# Altium schematic sheet SCH.SchDoc
size A4
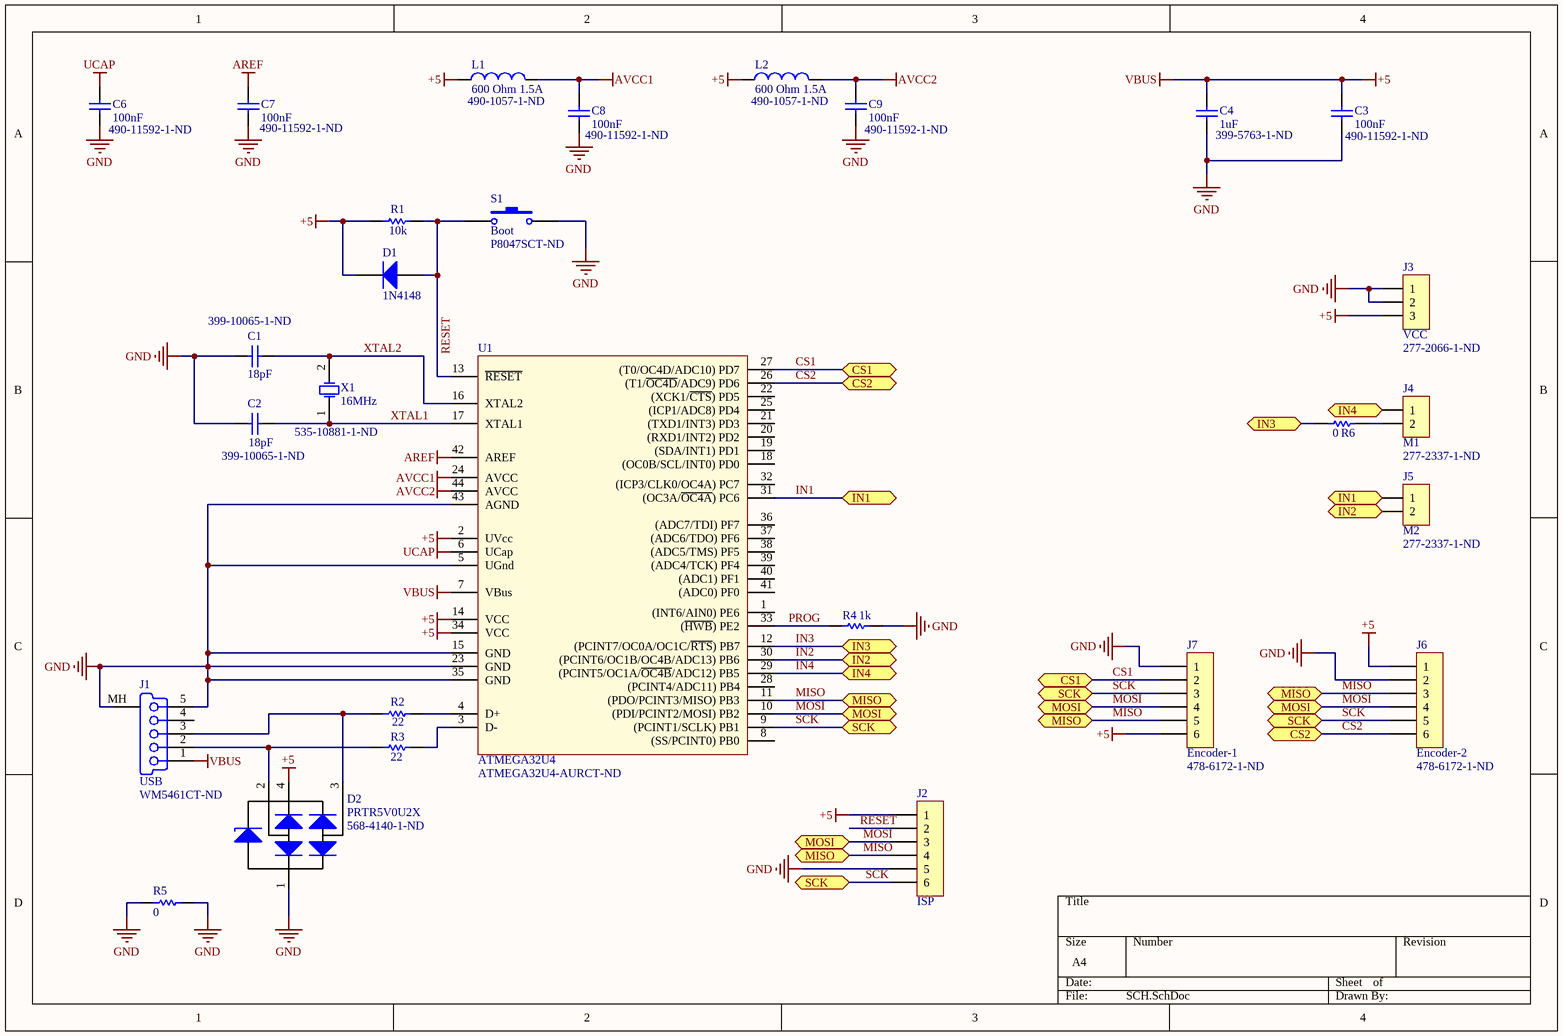
[diagram p0: SCH.SchDoc]

## Parts
C1  18pF  Supplier Part Number 1: 399-10065-1-ND  [C0805]
C2  18pF  Supplier Part Number 1: 399-10065-1-ND  [C0805]
C3  100nF  Supplier Part Number 1: 490-11592-1-ND  [C0805]
C4  1uF  Supplier Part Number 1: 399-5763-1-ND  [C0805]
C6  100nF  Supplier Part Number 1: 490-11592-1-ND  [C0805]
C7  100nF  Supplier Part Number 1: 490-11592-1-ND  [C0805]
C8  100nF  Supplier Part Number 1: 490-11592-1-ND  [C0805]
C9  100nF  Supplier Part Number 1: 490-11592-1-ND  [C0805]
D1  1N4148  [SOD-123]
D2  PRTR5V0U2X  Supplier Part Number 1: 568-4140-1-ND  [SOT143B]
J1  USB  Supplier Part Number 1: WM5461CT-ND  [USB Mini-B SMD]
J2  ISP  [Header-3x2]
J3  VCC  Supplier Part Number 1: 277-2066-1-ND  [TB_SMD_3v]
J4  M1  Supplier Part Number 3: 277-2337-1-ND  [TB_SMD_2V]
J5  M2  Supplier Part Number 3: 277-2337-1-ND  [TB_SMD_2V]
J6  Encoder-2  Supplier Part Number 4: 478-6172-1-ND  [Poke Home H6]
J7  Encoder-1  Supplier Part Number 1: 478-6172-1-ND  [Poke Home H6]
L1  600 Ohm 1.5A  Supplier Part Number 1: 490-1057-1-ND  [CC_1206]
L2  600 Ohm 1.5A  Supplier Part Number 1: 490-1057-1-ND  [CC_1206]
R1  10k  [RES_1206]
R2  22  [RES_1206]
R3  22  [RES_1206]
R4  1k  [RES_1206]
R5  0  [1206-0Ohm]
R6  0  [1206-0Ohm]
S1  Boot  Supplier Part Number 1: P8047SCT-ND  [EVQPL]
U1  ATMEGA32U4  Supplier Part Number 1: ATMEGA32U4-AURCT-ND  [TQFP44]
X1  16MHz  Supplier Part Number 1: 535-10881-1-ND  [ABM2 - XTAL]

## Ports
CS1, CS2, IN1, IN2, IN3, IN4, MISO, MOSI, SCK

## Nets
+5: C3.2 C4.2 D1.1(K) D2.4(VBUS) J1.1(V_BUS_(5V)) J2.1 J3.3 J6.1 J7.6 L1.1 L2.1 R1.1 U1.2(UVcc) U1.7(VBus) U1.14(VCC) U1.34(VCC)  [also labelled VBUS]
AREF: C7.2 U1.42(AREF)
AVCC1: C8.2 L1.2 U1.24(AVCC)
AVCC2: C9.1 L2.2 U1.44(AVCC)
GND: C1.1 C2.1 C3.1 C4.1 C6.1 C7.1 C8.1 C9.2 D2.1(GND) J1.5(GND) J1.MH(Tab) J2.5 J3.1 J3.2 J6.2 J7.1 R4.2 R5.1 R5.2 S1.2 U1.5(UGnd) U1.15(GND) U1.23(GND) U1.35(GND) U1.43(AGND)
UCAP: C6.2 U1.6(UCap)
CS1: J7.2 U1.27((T0/OC4D/ADC10)_PD7) ; port CS1
CS2: J6.6 U1.26((T1/~{OC4D}/ADC9)_PD6) ; port CS2
IN1: J5.1 U1.31((OC3A/~{OC4A})_PC6) ; port IN1
IN2: J5.2 U1.30((PCINT6/OC1B/OC4B/ADC13)_PB6) ; port IN2
IN3: R6.1 U1.12((PCINT7/OC0A/OC1C/~{RTS})_PB7) ; port IN3
IN4: J4.1 U1.29((PCINT5/OC1A/~{OC4B}/ADC12)_PB5) ; port IN4
MISO: J2.4 J6.3 J7.5 U1.11((PDO/PCINT3/MISO)_PB3) ; port MISO
MOSI: J2.3 J6.4 J7.4 U1.10((PDI/PCINT2/MOSI)_PB2) ; port MOSI
PROG: R4.1 U1.33((~{HWB})_PE2)
RESET: D1.2(A) J2.2 R1.2 S1.1 U1.13(~{RESET})
SCK: J2.6 J6.5 J7.3 U1.9((PCINT1/SCLK)_PB1) ; port SCK
XTAL1: C2.2 U1.17(XTAL1) X1.1(OSC1)
XTAL2: C1.2 U1.16(XTAL2) X1.2(OSC2)
NetD2_2: D2.2(IO1) J1.2(D-) R3.1
NetD2_3: D2.3(IO2) J1.3(D+) R2.1
NetJ4_2: J4.2 R6.2
NetR2_2: R2.2 U1.4(D+)
NetR3_2: R3.2 U1.3(D-)

Not connected (* = marked no-connect by the designer): J1 4(NC); U1 1((INT6/AIN0)_PE6) 8((SS/PCINT0)_PB0) 18((OC0B/SCL/INT0)_PD0) 19((SDA/INT1)_PD1) 20((RXD1/INT2)_PD2) 21((TXD1/INT3)_PD3) 22((XCK1/~{CTS})_PD5) 25((ICP1/ADC8)_PD4) 28((PCINT4/ADC11)_PB4) 32((ICP3/CLK0/OC4A)_PC7) 36((ADC7/TDI)_PF7) 37((ADC6/TDO)_PF6) 38((ADC5/TMS)_PF5) 39((ADC4/TCK)_PF4) 40((ADC1)_PF1) 41((ADC0)_PF0)

## Library data of the parts
C1-C4 C6-C9 = CAP_CERAMICO: Ceramic/Tantalum Capacitor; Supplier 1: Digi-Key
D1 = Diodo
D2 = ESD-USB: TVS DIODE 5.5VWM SOT143B; Supplier 1: Digi-Key
J1 = USB Mini-B: USB On-The-Go (OTG) Mini-B Receptacle, Right Angle, Thru-Hole, 0.80mm (.031") Pitch, Solder Tails & Shell Tabs with Dimples; PCB_Layout: Complies with Manufacturer's Recommendation.; Published: 30-May-2008; DatasheetVersion: rev0, Mar-2004; PackageVersion: rev0, Mar-2004; PackageReference: 5000750517; Publisher: Altium Limited; PackageDescription: USB Mini-B, Type 2, Thru-Hole; 5 Position; Vertical, Body 7.7 x 4.2 x 7.7 mm (LxWxH); ComponentLink1Description: Manufacturer Link; ComponentLink1URL: http://www.molex.com/; ComponentLink2Description: Datasheet; ComponentLink2URL: http://www.molex.com/pdm_docs/sd/5000750517_sd.pdf; Supplier 1: Digi-Key
J2 = Header_6: 6-pin male header
J3 = TB_3: 3-ways Terminal Block; Supplier 1: Digi-Key
J4 J5 = TB_2: Terminal Block 2 ways; Supplier 1: Digi-Key; Supplier 2: Digi-Key; Supplier 3: Digi-Key; Supplier 4: Digi-Key
J6 J7 = TB_6: 6-ways Terminal Block; Supplier 1: Digi-Key
  J6: Supplier 2: Digi-Key; Supplier 3: Digi-Key; Supplier 4: Digi-Key; Supplier 5: Digi-Key
L1 L2 = Inductor: Supplier 1: Digi-Key
R1-R6 = Resistor
S1 = BUTTON: Switch Button; Published: 24-Mar-1999; LatestRevisionDate: 17-Jul-2002; LatestRevisionNote: Re-released for DXP Platform.; PackageReference: SPST-2; Publisher: Altium Limited; PackageDescription: Switch; 2 Leads; Supplier 1: Digi-Key
U1 = ATMEGA32U4: AVR ATmega Microcontroller IC 8-Bit 16MHz 32KB (16K x 16) FLASH; Supplier 1: Digi-Key
X1 = Oscillator: Crystal Oscillator; Supplier 1: Digi-Key